# EAGLE design Div4RX5808-PRO MB_V1.2 (EAGLE 6.4)
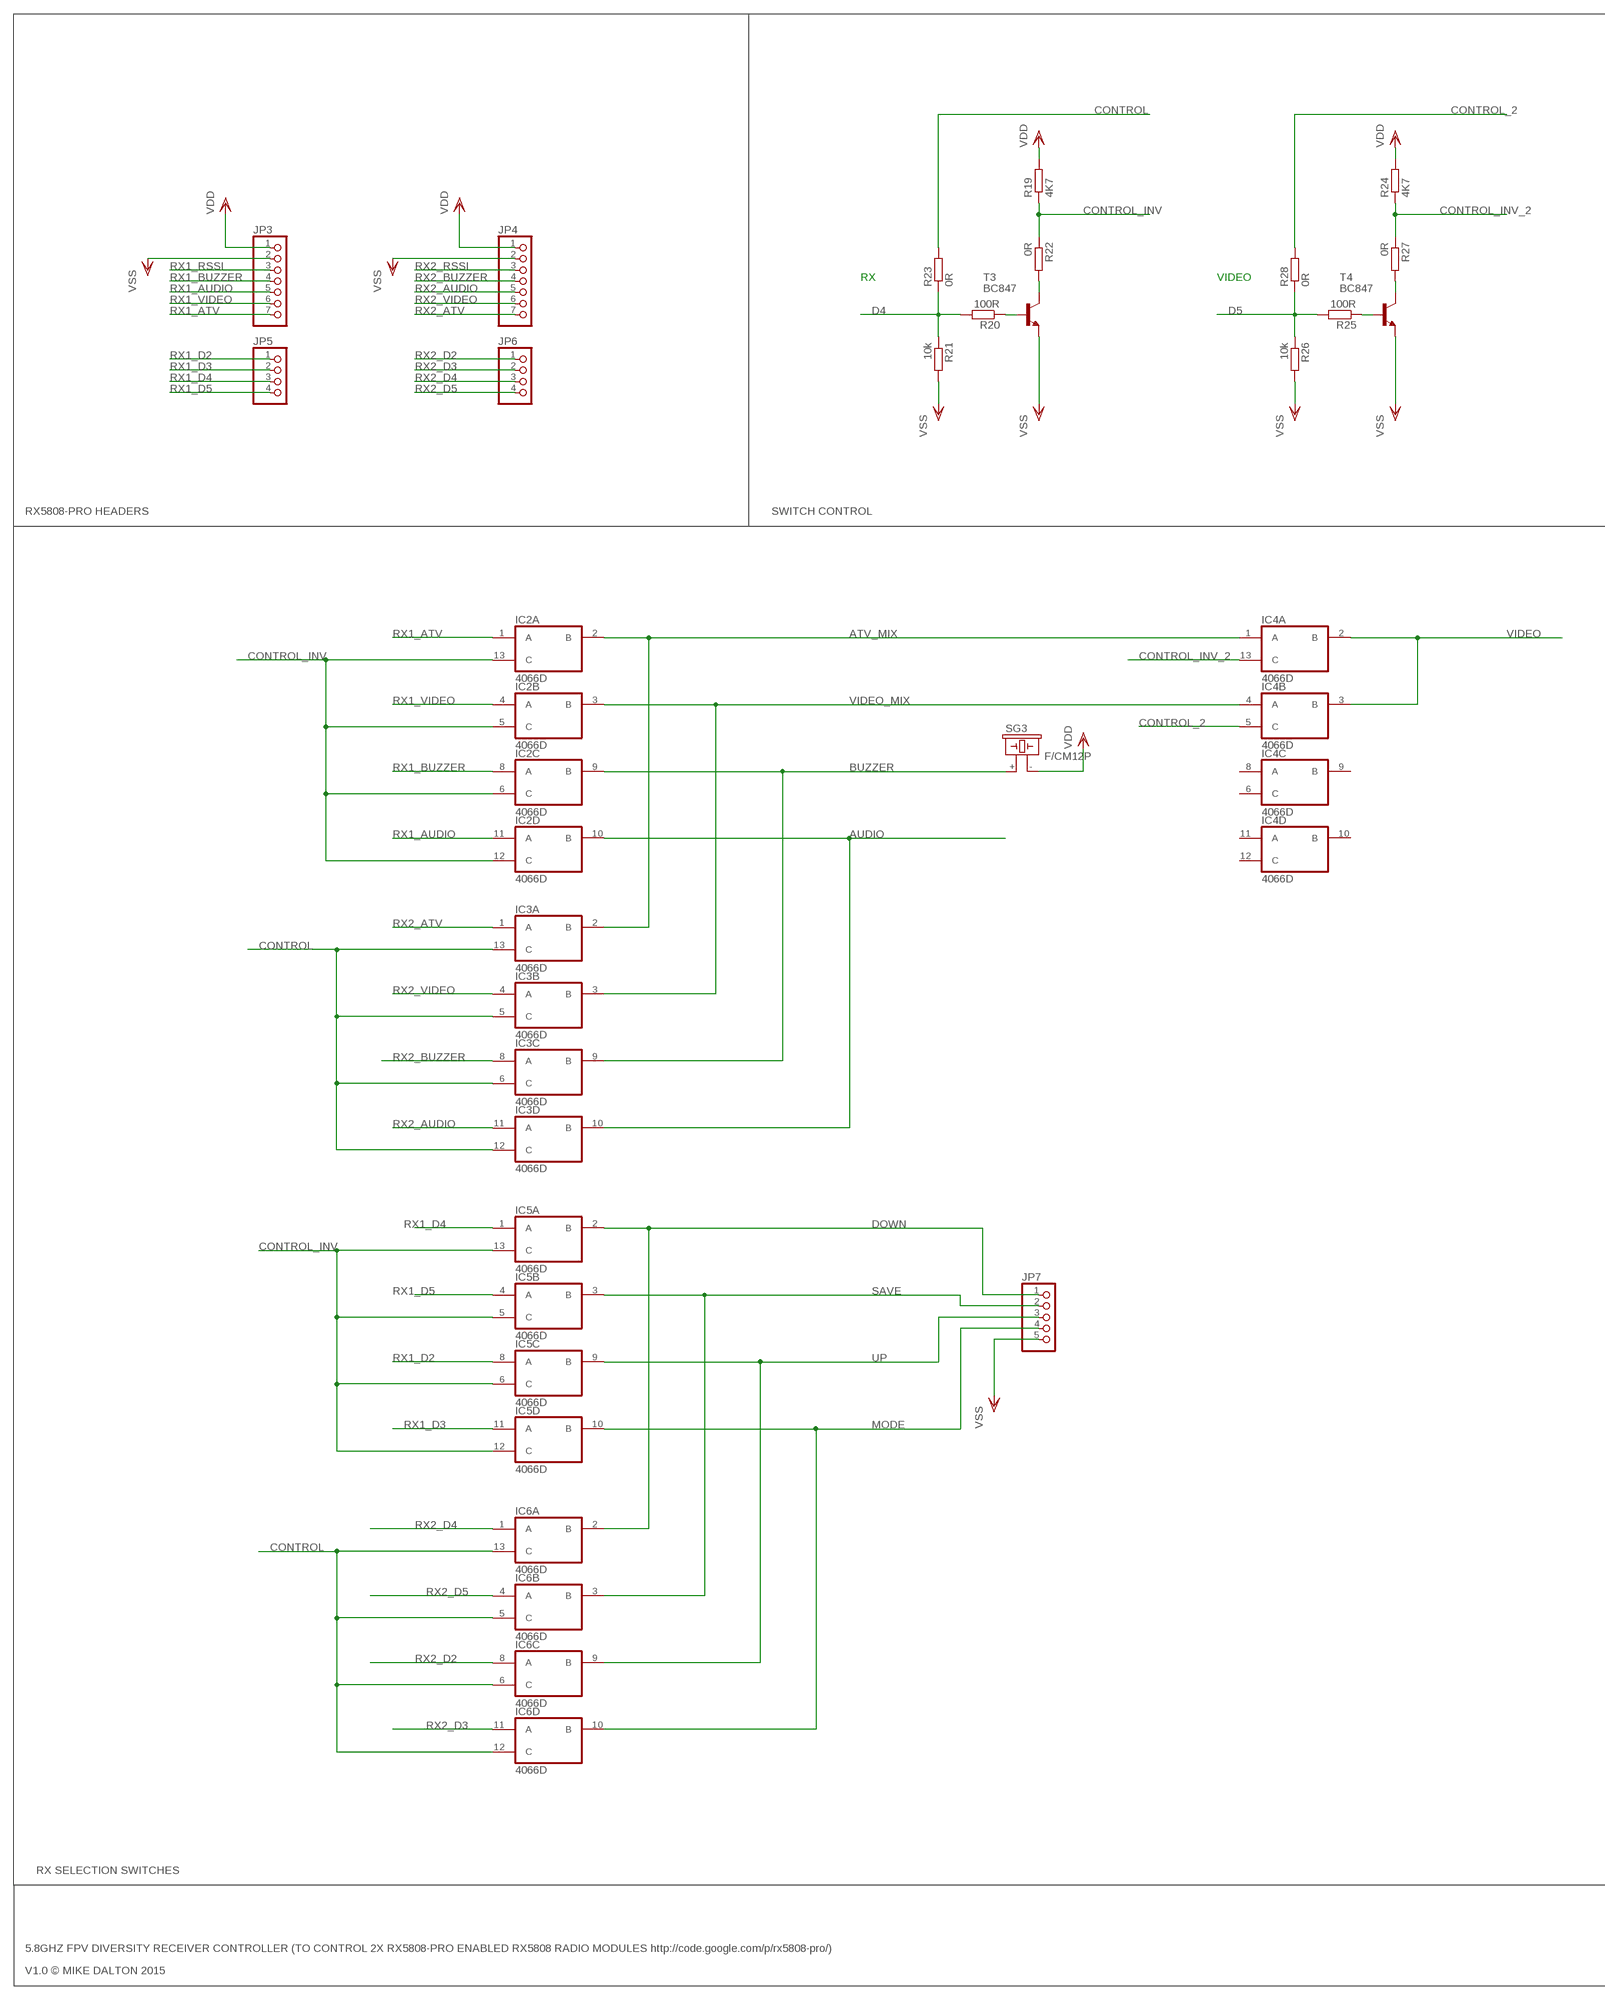
[diagram p0: schematic, sheet 1, part 1 of 2]
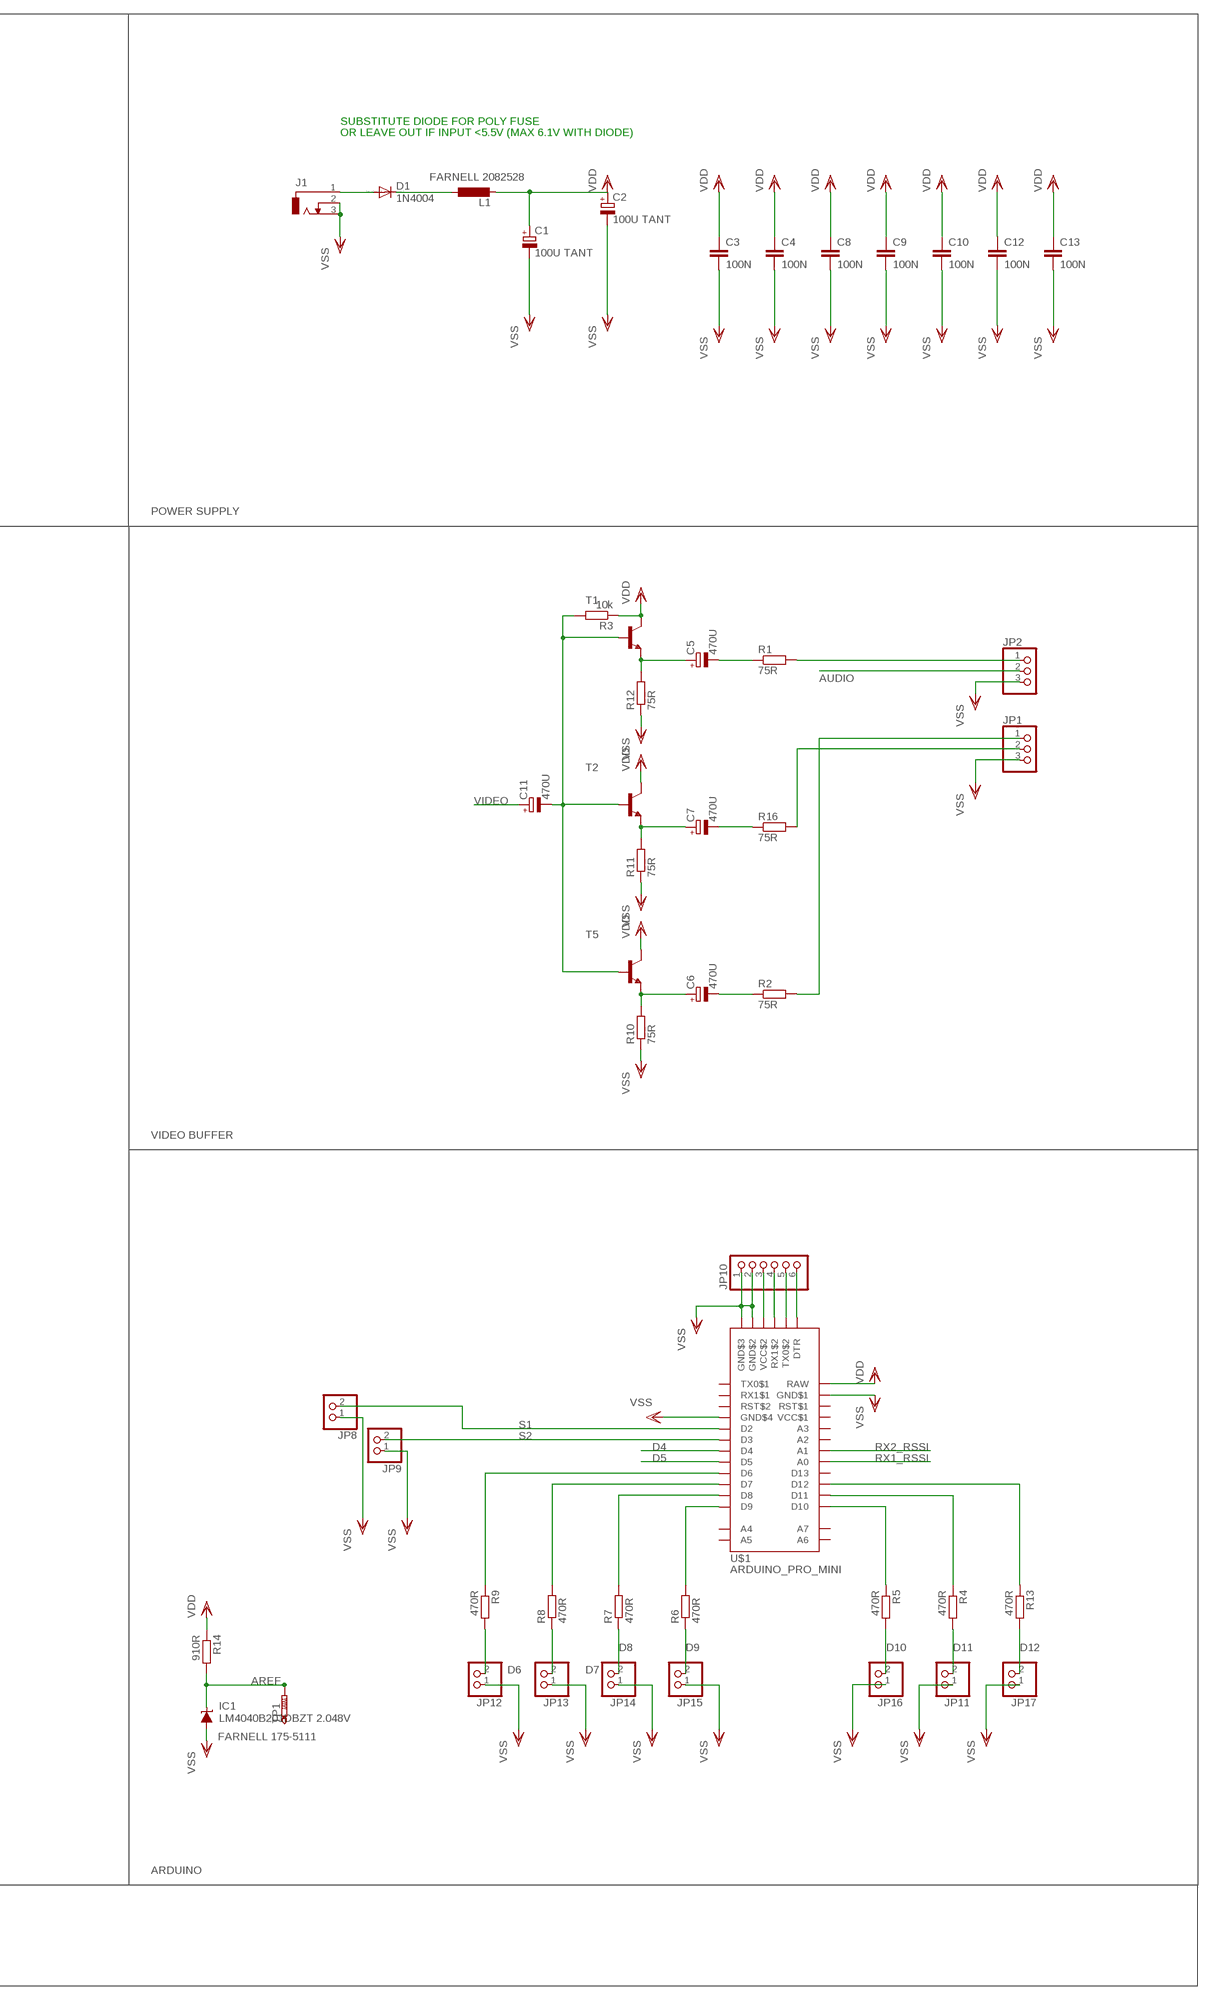
[diagram p1: schematic, sheet 1, part 2 of 2]

## Parts
C1  100U TANT  CPOL-EUC/6032-28R  [C/6032-28R]
C2  100U TANT  CPOL-EUC/6032-28R  [C/6032-28R]
C3  100N  C-EUC0603  [C0603]
C4  100N  C-EUC0603  [C0603]
C5  470U  CPOL-EUE5-10.5  [E5-10,5]
C6  470U  CPOL-EUE5-10.5  [E5-10,5]
C7  470U  CPOL-EUE5-10.5  [E5-10,5]
C8  100N  C-EUC0603  [C0603]
C9  100N  C-EUC0603  [C0603]
C10  100N  C-EUC0603  [C0603]
C11  470U  CPOL-EUE5-10.5  [E5-10,5]
C12  100N  C-EUC0603  [C0603]
C13  100N  C-EUC0603  [C0603]
D1  1N4004  [DO41-10]
IC1  LM4040B201DBZT 2.048V  LM4041A12DBZ  [DBZ_R-PDSO-G3]
IC2  4066D  [SO14]
IC3  4066D  [SO14]
IC4  4066D  [SO14]
IC5  4066D  [SO14]
IC6  4066D  [SO14]
J1  DCJ0303  [DCJ0303]
JP1  PINHD-1X3  [1X03]
JP2  PINHD-1X3  [1X03]
JP3  PINHD-1X7  [1X07]
JP4  PINHD-1X7  [1X07]
JP5  PINHD-1X4  [1X04]
JP6  PINHD-1X4  [1X04]
JP7  PINHD-1X5  [1X05]
JP8  PINHD-1X2  [1X02]
JP9  PINHD-1X2  [1X02]
JP10  PINHD-1X6  [1X06]
JP11  PINHD-1X2  [1X02]
JP12  PINHD-1X2  [1X02]
JP13  PINHD-1X2  [1X02]
JP14  PINHD-1X2  [1X02]
JP15  PINHD-1X2  [1X02]
JP16  PINHD-1X2  [1X02]
JP17  PINHD-1X2  [1X02]
L1  L-EU0207/7  [0207/7]
R1  75R  R-EU_M0805  [M0805]
R2  75R  R-EU_M0805  [M0805]
R3  10k  R-EU_M0805  [M0805]
R4  470R  R-EU_R0603  [R0603]
R5  470R  R-EU_R0603  [R0603]
R6  470R  R-EU_R0603  [R0603]
R7  470R  R-EU_R0603  [R0603]
R8  470R  R-EU_R0603  [R0603]
R9  470R  R-EU_R0603  [R0603]
R10  75R  R-EU_M0805  [M0805]
R11  75R  R-EU_M0805  [M0805]
R12  75R  R-EU_M0805  [M0805]
R13  470R  R-EU_R0603  [R0603]
R14  910R  R-EU_R0603  [R0603]
R16  75R  R-EU_M0805  [M0805]
R19  4K7  R-EU_M0805  [M0805]
R20  100R  R-EU_M0805  [M0805]
R21  10k  R-EU_M0805  [M0805]
R22  0R  R-EU_M0805  [M0805]
R23  0R  R-EU_M0805  [M0805]
R24  4K7  R-EU_M0805  [M0805]
R25  100R  R-EU_M0805  [M0805]
R26  10k  R-EU_M0805  [M0805]
R27  0R  R-EU_M0805  [M0805]
R28  0R  R-EU_M0805  [M0805]
SG3  F/CM12P  [F/CM12P]
T1  MMBT2222ALT1-NPN-SOT23-BEC  [SOT23-BEC]
T2  MMBT2222ALT1-NPN-SOT23-BEC  [SOT23-BEC]
T3  BC847  BC847B-NPN-SOT23-BEC  [SOT23-BEC]
T4  BC847  BC847B-NPN-SOT23-BEC  [SOT23-BEC]
T5  MMBT2222ALT1-NPN-SOT23-BEC  [SOT23-BEC]
TP1  PTR1TP20SQ  [TP20SQ]
U$1  ARDUINO_PRO_MINI  [ARDUINO_PRO_MINI]

## Nets
AREF: IC1.1(C) R14.2 TP1.TP
ATV_MIX: IC2.2(A:B) IC3.2(A:B) IC4.1(A:A)
AUDIO: IC2.10(D:B) IC3.10(D:B) JP2.2
BUZZER: IC2.9(C:B) IC3.9(C:B) SG3.+
CONTROL: IC3.5(B:C) IC3.6(C:C) IC3.12(D:C) IC3.13(A:C) IC6.5(B:C) IC6.6(C:C) IC6.12(D:C) IC6.13(A:C) R23.2
CONTROL_2: IC4.5(B:C) R28.2
CONTROL_INV: IC2.5(B:C) IC2.6(C:C) IC2.12(D:C) IC2.13(A:C) IC5.5(B:C) IC5.6(C:C) IC5.12(D:C) IC5.13(A:C) R19.1 R22.1
CONTROL_INV_2: IC4.13(A:C) R24.1 R27.1
D4: R20.2 R21.1 R23.1 U$1.D4
D5: R25.2 R26.1 R28.1 U$1.D5
D6: JP12.2 R9.2
D7: JP13.2 R8.1
D8: JP14.2 R7.1
D9: JP15.2 R6.1
D10: JP16.2 R5.2
D11: JP11.2 R4.2
D12: JP17.2 R13.2
DOWN: IC5.2(A:B) IC6.2(A:B) JP7.1
MODE: IC5.10(D:B) IC6.10(D:B) JP7.4
N$1: D1.C L1.1
N$3: D1.A J1.1
N$4: R13.1 U$1.D12
N$5: C5.- R1.1
N$6: C6.- R2.1
N$16: JP2.1 R1.2
N$18: C7.- R16.1
N$24: JP1.2 R16.2
N$25: JP1.1 R2.2
N$26: C5.+ R12.2 T1.E
N$30: JP10.6 U$1.DTR
N$32: JP10.5 U$1.TX0$2
N$33: C7.+ R11.2 T2.E
N$35: JP10.4 U$1.RX1$2
N$36: JP10.3 U$1.VCC$2
N$47: R25.1 T4.B
N$48: C6.+ R10.2 T5.E
N$49: R22.2 T3.C
N$50: R20.1 T3.B
N$51: R27.2 T4.C
N$52: C11.- R3.2 T1.B T2.B T5.B
N$58: R9.1 U$1.D6
N$59: R8.2 U$1.D7
N$62: R6.2 U$1.D9
N$64: R4.1 U$1.D11
N$65: R5.1 U$1.D10
N$590: R7.2 U$1.D8
RX1_ATV: IC2.1(A:A) JP3.7
RX1_AUDIO: IC2.11(D:A) JP3.5
RX1_BUZZER: IC2.8(C:A) JP3.4
RX1_D2: IC5.8(C:A) JP5.1
RX1_D3: IC5.11(D:A) JP5.2
RX1_D4: IC5.1(A:A) JP5.3
RX1_D5: IC5.4(B:A) JP5.4
RX1_RSSI: JP3.3 U$1.A0
RX1_VIDEO: IC2.4(B:A) JP3.6
RX2_ATV: IC3.1(A:A) JP4.7
RX2_AUDIO: IC3.11(D:A) JP4.5
RX2_BUZZER: IC3.8(C:A) JP4.4
RX2_D2: IC6.8(C:A) JP6.1
RX2_D3: IC6.11(D:A) JP6.2
RX2_D4: IC6.1(A:A) JP6.3
RX2_D5: IC6.4(B:A) JP6.4
RX2_RSSI: JP4.3 U$1.A1
RX2_VIDEO: IC3.4(B:A) JP4.6
S1: JP8.2 U$1.D2
S2: JP9.2 U$1.D3
SAVE: IC5.3(B:B) IC6.3(B:B) JP7.2
UP: IC5.9(C:B) IC6.9(C:B) JP7.3
VDD: C1.+ C2.+ C3.1 C4.1 C8.1 C9.1 C10.1 C12.1 C13.1 JP3.1 JP4.1 L1.2 R3.1 R14.1 R19.2 R24.2 SG3.- T1.C T2.C T5.C U$1.RAW
VIDEO: C11.+ IC4.2(A:B) IC4.3(B:B)
VIDEO_MIX: IC2.3(B:B) IC3.3(B:B) IC4.4(B:A)
VSS: C1.- C2.- C3.2 C4.2 C8.2 C9.2 C10.2 C12.2 C13.2 IC1.2(A) J1.2 J1.3 JP1.3 JP2.3 JP3.2 JP4.2 JP7.5 JP8.1 JP9.1 JP10.1 JP10.2 JP11.1 JP12.1 JP13.1 JP14.1 JP15.1 JP16.1 JP17.1 R10.1 R11.1 R12.1 R21.2 R26.2 T3.E T4.E U$1.GDN$1(GND$1) U$1.GND$2 U$1.GND$3 U$1.GND$4
Unconnected: IC4.6(C:C) IC4.8(C:A) IC4.9(C:B) IC4.10(D:B) IC4.11(D:A) IC4.12(D:C) U$1.A2 U$1.A3 U$1.A4 U$1.A5 U$1.A6 U$1.A7 U$1.D13 U$1.RST$1 U$1.RST$2 U$1.RX1$1 U$1.TX0$1

## Notes on the sheet
- SUBSTITUTE DIODE FOR POLY FUSE
- OR LEAVE OUT IF INPUT <5.5V (MAX 6.1V WITH DIODE)
- FARNELL 2082528
- RX | VIDEO
- RX5808-PRO HEADERS | SWITCH CONTROL | POWER SUPPLY
- VIDEO BUFFER
- FARNELL 175-5111
- RX SELECTION SWITCHES | ARDUINO
- 5.8GHZ FPV DIVERSITY RECEIVER CONTROLLER (TO CONTROL 2X RX5808-PRO ENABLED RX5808 RADIO MODULES http://code.google.com/p/rx5808-pro/)
- V1.0 © MIKE DALTON 2015

## Power pins joined to a net without a drawn wire
VCC$1: U$1.VCC$1
VDD: IC2.14(P:VDD) IC3.14(P:VDD) IC4.14(P:VDD) IC5.14(P:VDD) IC6.14(P:VDD)
VSS: IC2.7(P:VSS) IC3.7(P:VSS) IC4.7(P:VSS) IC5.7(P:VSS) IC6.7(P:VSS)

## Library data of the parts
C1 C2 C5-C7 C11 = rcl:CPOL-EU: POLARIZED CAPACITOR, European symbol
C3 C4 C8-C10 C12 C13 = rcl:C-EU: CAPACITOR, European symbol
D1 = diode:1N4004: DIODE general purpose rectifier, 1 A
IC1 = texas:LM4041: PRECISION MICROPOWER SHUNT VOLTAGE REFERENCE Source: http://focus.ti.com/lit/ds/slcs146e/slcs146e.pdf; MPN: LM4041A12IDBZR; OC_FARNELL: 1407949; OC_NEWARK: 58K5875
IC2-IC6 = 40xx:4066: Quad bilateral ANALOG SWITCH
J1 = con-jack:DCJ0303: DC POWER JACK Source: DCJ0303.pdf; OC_FARNELL: unknown; OC_NEWARK: unknown
JP1 JP2 = pinhead:PINHD-1X3: PIN HEADER
JP3 JP4 = pinhead:PINHD-1X7: PIN HEADER
JP5 JP6 = pinhead:PINHD-1X4: PIN HEADER
JP7 = pinhead:PINHD-1X5: PIN HEADER
JP8 JP9 JP11-JP17 = pinhead:PINHD-1X2: PIN HEADER
JP10 = pinhead:PINHD-1X6: PIN HEADER
L1 = rcl:L-EU: INDUCTOR, European symbol
R1-R14 R16 R19-R28 = rcl:R-EU_: RESISTOR, European symbol
SG3 = buzzer:F/CM12P: BUZZER Source: Buerklin; OC_FARNELL: unknown; OC_NEWARK: unknown
T1 T2 T5 = transistor-neu-to92:*-NPN-: NPN Transistror BF959 corrected 2008.03.06
T3 T4 = transistor:*-NPN-: NPN Transistror BF959 corrected 2008.03.06
TP1 = testpad:PTR1: TEST PIN
U$1 = srg:ARDUINO_PRO_MINI: Arduino Pro-Mini Made by Sparkfun Comes in 3.3 volt <http://www.sparkfun.com/products/11113> and 5 volt <http://www.sparkfun.com/products/11114> versions Note: A6 & A7 are analog in only

## Board
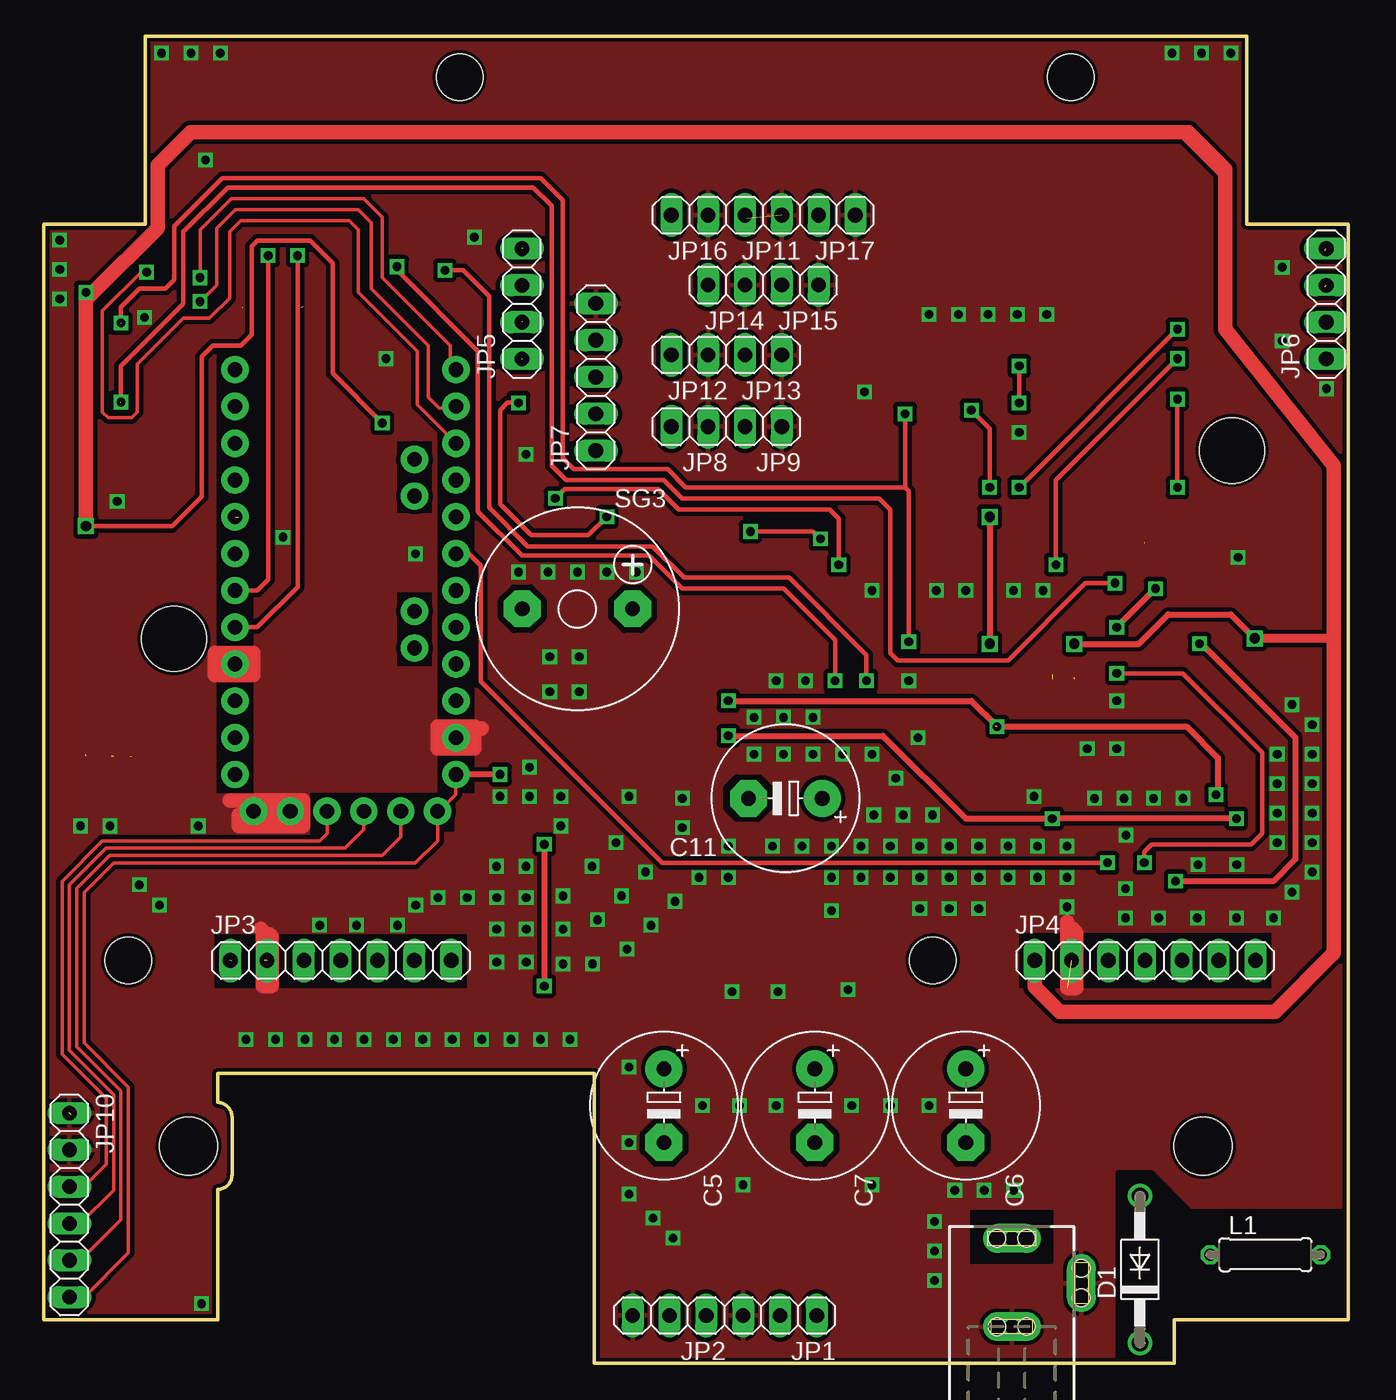
[diagram p2: board, top side]
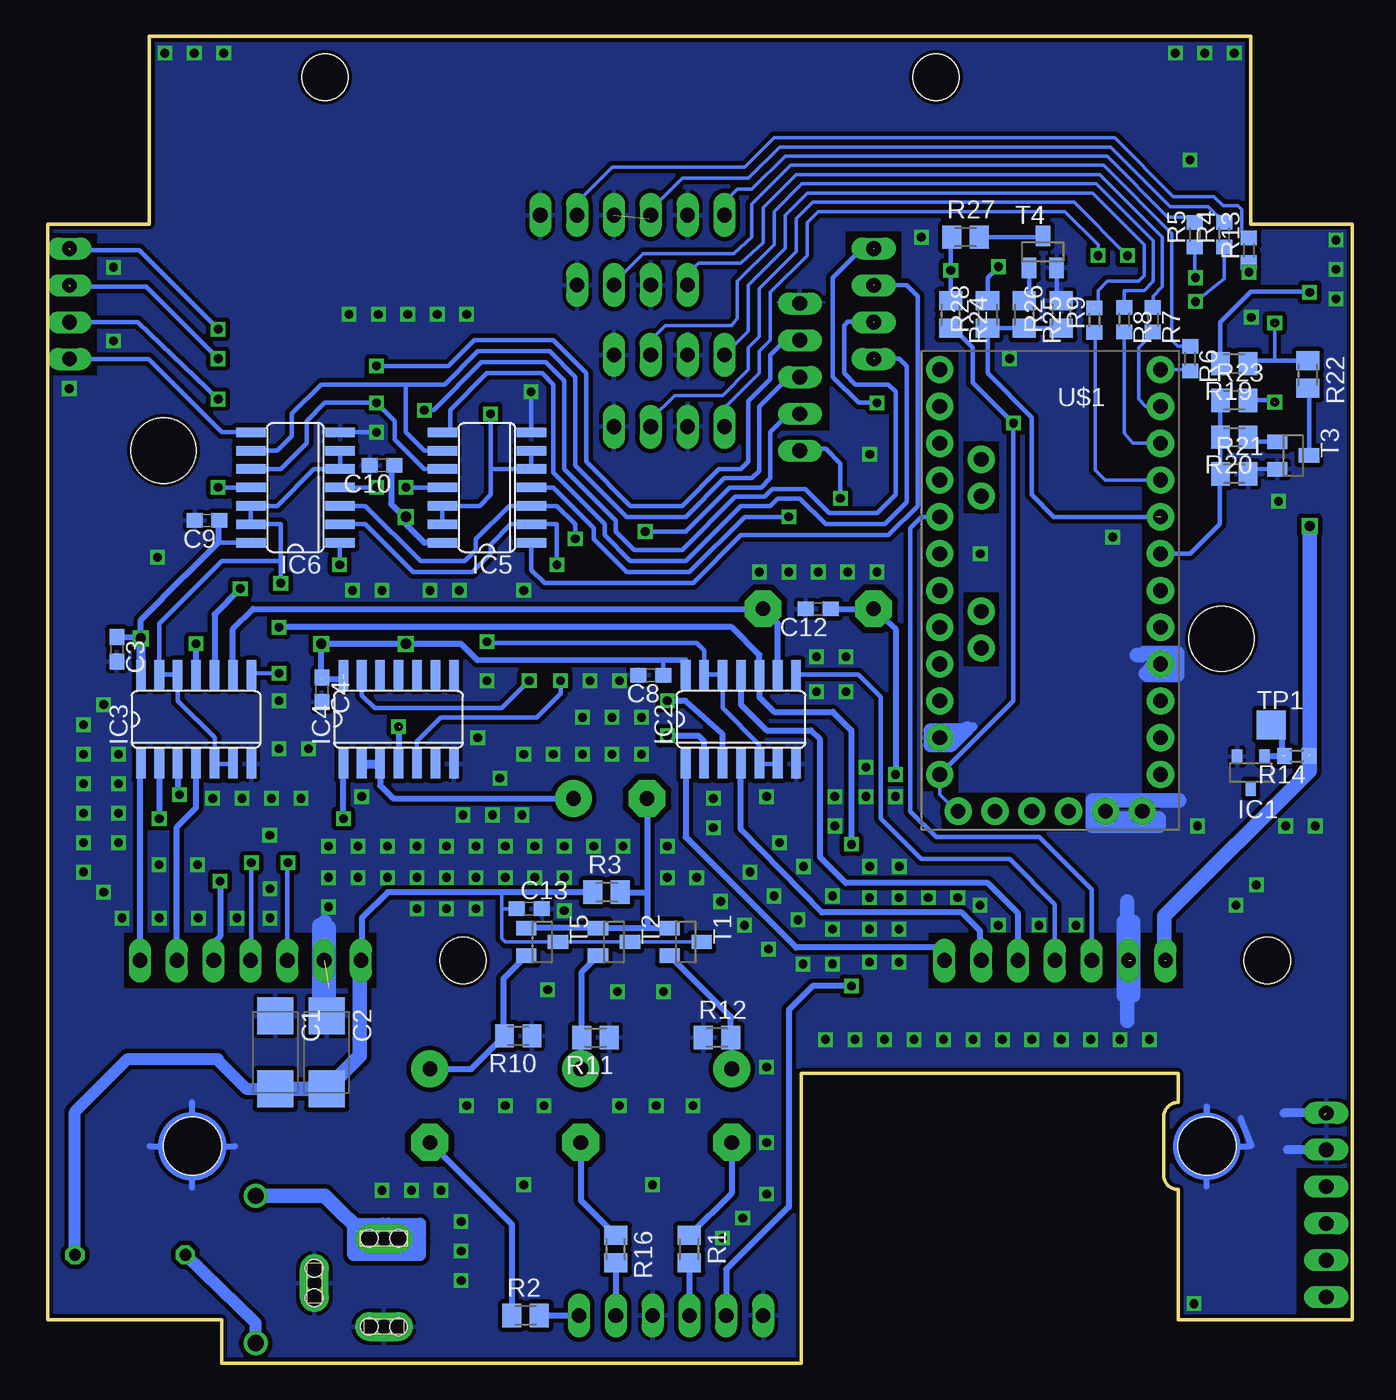
[diagram p3: board, bottom side, seen from below]

Size 90 x 91.59 mm. Coordinates in mm from the lower left corner, seen from the top.
Outline: 38,0 78,0 78,3 90,3 90,78.64 83,78.64 83,91.59 7,91.59 7,78.64 0,78.64 0,3 12,3 12,12 arc90 13,13 13,17 arc90 12,18 12,20 38,20 38,0
Copper layers (1*16): Top 0.035mm / dielectric 1.5mm / Bottom 0.035mm
Design rules "default *": minimum track width 10mil, minimum drill 24mil, track to track 12mil, track to pad 12mil, pad to pad 12mil, via to via 12mil, smd to smd 12mil, copper to edge 10mil, drill to drill 10mil, minimum pad ring 10mil, minimum via ring 8mil, stop-mask expansion 4mil, vias tented up to drill 0mil, thermal gap 10mil
Holes 4 mm at 80,15 10,15
Holes 4.5 mm at 9,50 82,63
Holes 1.2 mm at 65.79,8.64 67.82,8.64 71.6,6.55 71.6,4.52 67.82,2.54 65.79,2.51
Holes 3.2 mm at 28.7,88.77 70.87,88.77 61.34,27.81 5.84,27.81
bKeepout: area 11.9,36.8 to 14.4,69.8
tRestrict: area 18.4,36.7 to 28.3,39.4; area 11.9,39.4 to 14.5,47; area 11.9,49.5 to 14.5,69.8; area 27.2,39.4 to 29.7,41.9; area 27.2,44.5 to 29.7,69.8; area 24.4,48.1 to 26.8,53.2; area 24.4,58.7 to 26.8,63.6; area 67.3,25.9 to 84.7,29.7; area 11.8,25.9 to 29.2,29.6; area 64,6.9 to 69.5,10.5; area 74,-0.4 to 90,13.2; 102 lines
bRestrict: area 27.2,39.5 to 29.6,69.8; area 18.4,36.7 to 28.3,39.4; area 24.4,58.7 to 26.8,63.5; area 24.4,63.4 to 26.8,63.6; area 24.4,48.1 to 26.8,53.2; area 86.6,68.2 to 90,78; area 0.1,-1.9 to 3.8,13.5; area 36.1,64.4 to 40,73.2; area 31.1,68.2 to 34.9,78.1; area 67.3,25.9 to 84.7,29.7; area 11.7,25.9 to 29.2,29.7; area 11.9,39.4 to 14.5,47; 1 more areas; 111 lines

### Footprints (pad centres in the part's own frame; a part is rotated, then mirrored left to right if it is on the bottom)
C/6032-28R = smd 2.55 x 2.5: + 2.525,0; - -2.525,0
C0603 = smd 1.1 x 1: 1 -0.85,0; 2 0.85,0
E5-10,5 = drill 1.016 pad 2.54: + -2.54,0 | drill 1.016 pad 2.54 octagon: - 2.54,0
DO41-10 = drill 1.118: A 5.08,0; C -5.08,0
DBZ_R-PDSO-G3 = smd 0.7 x 1: 1 -0.95,-1.1; 2 0.95,-1.1; 3 0,1.1
SO14 = smd 0.66 x 2.032: 1 -3.81,-3.073; 2 -2.54,-3.073; 3 -1.27,-3.073; 4 0,-3.073; 5 1.27,-3.073; 6 2.54,-3.073; 7 3.81,-3.073; 8 3.81,3.073; 9 2.54,3.073; 10 1.27,3.073; 11 0,3.073; 12 -1.27,3.073; 13 -2.54,3.073; 14 -3.81,3.073
DCJ0303 = drill 1 pad 2 long: 1 0,3.1; 2 4.8,0; 3 0,-3
1X03 = drill 1.016 long: 1 -2.54,0; 2 0,0; 3 2.54,0
1X07 = drill 1.016 long: 1 -7.62,0; 2 -5.08,0; 3 -2.54,0; 4 0,0; 5 2.54,0; 6 5.08,0; 7 7.62,0
1X04 = drill 1.016 long: 1 -3.81,0; 2 -1.27,0; 3 1.27,0; 4 3.81,0
1X05 = drill 1.016 long: 1 -5.08,0; 2 -2.54,0; 3 0,0; 4 2.54,0; 5 5.08,0
1X02 = drill 1.016 long: 1 -1.27,0; 2 1.27,0
1X06 = drill 1.016 long: 1 -6.35,0; 2 -3.81,0; 3 -1.27,0; 4 1.27,0; 5 3.81,0; 6 6.35,0
0207/7 = drill 0.813 octagon: 1 -3.81,0; 2 3.81,0
M0805 = smd 1.3 x 1.6: 1 -0.95,0; 2 0.95,0
R0603 = smd 1 x 1.1: 1 -0.85,0; 2 0.85,0
F/CM12P = drill 1.016 pad 2.54 octagon: + 3.81,0; - -3.81,0
SOT23-BEC = smd 1 x 1.4: B -0.95,-1.1; C 0,1.1; E 0.95,-1.1
TP20SQ = smd 2 x 2: TP 0,0
ARDUINO_PRO_MINI = drill 1.016 pad 1.88: A0 7.62,-5.08; A1 7.62,-2.54; A2 7.62,0; A3 7.62,2.54; A4 4.763,1.429; A5 4.763,3.969; A6 4.763,-9.049; A7 4.763,-6.509; D2 -7.62,2.54; D3 -7.62,0; D4 -7.62,-2.54; D5 -7.62,-5.08; D6 -7.62,-7.62; D7 -7.62,-10.16; D8 -7.62,-12.7; D9 -7.62,-15.24; D10 7.62,-15.24; D11 7.62,-12.7; D12 7.62,-10.16; D13 7.62,-7.62; DTR 6.35,15.24; GDN$1 7.62,10.16; GND$2 -3.81,15.24; GND$3 -6.35,15.24; GND$4 -7.62,5.08; RAW 7.62,12.7; RST$1 7.62,7.62; RST$2 -7.62,7.62; RX1$1 -7.62,10.16; RX1$2 1.27,15.24; TX0$1 -7.62,12.7; TX0$2 3.81,15.24; VCC$1 7.62,5.08; VCC$2 -1.27,15.24

### Placement (x,y rotation side)
C1  74.3,21.46 270 bottom
C2  70.74,21.46 270 bottom
C3  85.22,49.28 270 bottom
C4  71.07,46.48 270 bottom
C5  42.8,17.78 270 top
C6  63.63,17.78 270 top
C7  53.21,17.78 270 top
C8  48.39,47.5 180 bottom
C9  78.99,58.17 180 bottom
C10  66.93,61.98 180 bottom
C11  51.18,38.99 180 top
C12  36.83,52.07 180 bottom
C13  56.77,31.37 0 bottom
D1  75.64,6.48 90 top
IC1  6.99,40.77 180 bottom
IC2  42.16,44.45 0 bottom
IC3  79.76,44.45 0 bottom
IC4  65.79,44.45 0 bottom
IC5  59.69,60.45 90 bottom
IC6  72.9,60.45 90 bottom
J1  66.8,5.53 0 top
JP1  50.8,3.3 180 top
JP2  43.18,3.3 180 top
JP3  20.5,27.8 0 top
JP4  76,27.8 0 top
JP5  33,73.13 90 top
JP6  88.5,73.13 90 top
JP7  38.1,68.07 90 top
JP8  44.58,64.64 180 top
JP9  49.66,64.64 180 top
JP10  1.78,10.92 270 top
JP11  49.66,79.25 180 top
JP12  44.58,69.6 180 top
JP13  49.66,69.6 180 top
JP14  47.12,74.42 180 top
JP15  52.2,74.42 180 top
JP16  44.58,79.25 180 top
JP17  54.74,79.25 180 top
L1  84.3,7.49 0 top
R1  45.72,7.87 270 bottom
R2  57.02,3.3 0 bottom
R3  51.44,32.51 0 bottom
R4  8.81,77.9 90 bottom
R5  10.85,77.9 90 bottom
R6  11.18,69.34 270 bottom
R7  13.74,72.03 270 bottom
R8  15.72,72.03 270 bottom
R9  17.78,72.01 90 bottom
R10  57.53,22.61 180 bottom
R11  52.2,22.48 180 bottom
R12  43.81,22.48 0 bottom
R13  7.11,76.83 90 bottom
R14  3.81,41.91 180 bottom
R16  50.8,7.87 270 bottom
R19  8.13,69.01 180 bottom
R20  8.13,63.93 180 bottom
R21  8.13,61.39 0 bottom
R22  3.05,68.25 270 bottom
R23  8.13,66.47 0 bottom
R24  27.69,72.39 270 bottom
R25  22.61,72.39 270 bottom
R26  20.07,72.39 90 bottom
R27  26.67,77.72 0 bottom
R28  25.15,72.39 90 bottom
SG3  36.83,52.07 0 top
T1  45.97,29.08 270 bottom
T2  50.93,29.08 270 bottom
T3  4.06,62.66 270 bottom
T4  21.34,76.71 0 bottom
T5  55.88,29.08 270 bottom
TP1  5.59,44.07 0 bottom
U$1  20.83,53.34 180 bottom

### Tracks (layer width: path | path; a pad name or v marks a point on that pad's centre or on a via)
AREF  (2 unrouted)
  Bottom 0.406: 5.97,41.91 4.83,41.91 4.83,43.94 TP1.TP
ATV_MIX  (via drill 0.6)
  Top 0.406: v47.24,43.31 57.91,43.31 63.63,37.59 v69.6,37.59 v82.3,37.59
  Bottom 0.406: IC2.2 44.7,42.93 45.09,43.31 v47.24,43.31 | v69.6,37.59 IC4.1 | IC3.2 v82.3,37.59
AUDIO  (via drill 0.6)
  Top 0.406: v34.54,35.81 v34.54,26.04 | v74.04,50.8 v76.71,53.47
  Bottom 0.406: v34.54,35.81 34.54,43.69 35.81,44.96 39.88,44.96 40.89,45.97 IC2.10 40.89,48.9 42.8,50.8 v74.04,50.8 | v34.54,26.04 37.21,26.04 38.86,24.38 38.86,10.79 43.18,6.48 JP2.2 | v76.71,53.47 78.49,51.69 IC3.10
BUZZER
  Bottom 0.406: IC2.9 39.62,51.05 40.51,51.94 | 40.51,51.94 40.58,52.01 | 40.58,52.01 SG3.+ | IC3.9 77.22,50.67 75.82,52.07 SG3.+ | 40.39,52.07 40.51,51.94 | SG3.+ 39.75,51.82 40.58,52.01
CONTROL  (via drill 0.6)  (1 unrouted)
  Top 0.305: v73.91,53.85 71.88,53.85 66.55,48.51 58.93,48.51 58.42,49.02 58.42,58.93 57.66,59.69 44.07,59.69 42.8,60.96 36.07,60.96 35.05,61.98 35.05,79.88 33.78,81.15 12.7,81.15 9.65,78.11 9.65,73.15 5.33,68.83 5.33,66.29
  Bottom 0.305: IC6.6 IC6.5 71.63,61.72 74.17,59.18 IC6.12 IC6.13 73.91,57.91 73.91,55.37 | IC3.6 IC3.5 78.49,43.18 81.03,45.72 IC3.12 IC3.13 82.3,51.05 77.98,55.37 73.91,55.37 | R23.2 5.59,66.47 v5.33,66.34 | v73.91,53.85 73.91,55.37
CONTROL_2  (via drill 0.6)
  Top 0.305: v24.38,75.69 24.38,75.44 29.97,69.85 29.97,58.8 33.02,55.75 41.78,55.75 44.07,53.47 51.05,53.47 54.61,49.91 v54.61,47.12
  Bottom 0.305: R28.2 25.15,74.93 v24.38,75.69 | v54.61,47.12 54.61,46.23 56.26,44.58 62.87,44.58 64.52,42.93 IC4.5
CONTROL_INV  (via drill 0.6)  (1 unrouted)
  Top 0.305: v59.44,65.53 59.44,60.45 | 59.44,60.45 59.69,60.2 v59.69,49.81 | 59.44,60.45 44.32,60.45 43.05,61.72 36.58,61.72 35.81,62.48 35.81,80.26 34.29,81.79 12.32,81.79 9.02,78.49 9.02,74.8 8.38,74.17 6.6,74.17 5.33,72.9 5.33,71.75
  Bottom 0.254: v5.33,71.8 5.33,69.26 5.27,69.2
  Bottom 0.305: IC5.6 IC5.5 59.44,61.72 | IC5.13 IC5.12 60.2,59.18 59.44,59.94 59.44,61.72 | IC2.6 IC2.5 40.89,42.67 43.43,45.21 IC2.12 IC2.13 44.7,49.2 45.21,49.71 59.28,49.71 v59.69,49.81 | 59.44,61.72 v59.44,65.53 | R22.1 5.27,69.2 7.37,69.2 R19.1
CONTROL_INV_2  (via drill 0.6)
  Top 0.305: v27.69,75.44 28.96,75.44 30.73,73.66 30.73,59.05 33.4,56.39 42.04,56.39 44.2,54.23 51.44,54.23 56.77,48.9 v56.77,47.12
  Bottom 0.305: R24.1 v27.69,75.44 27.69,77.66 R27.1 | IC4.13 68.33,46.1 67.44,45.21 58.67,45.21 v56.77,47.12
D4
  Bottom 0.305: R21.1 R20.2 R23.1 | 9.59,60.88 R21.1 | U$1.D4 11.18,55.88 9.14,57.91 9.14,61.32 R21.1
D5  (1 unrouted)
  Bottom 0.305: R26.1 R25.2 R28.1 25.15,68.33 22.1,65.28 22.1,59.94 20.57,58.42 13.46,58.42 | 13.46,58.17 U$1.D5
D6  (1 unrouted)
  Bottom 0.254: 17.91,72.9 17.65,72.9 17.53,73.03 17.53,74.04 16.89,74.68 14.73,74.68 14.35,75.06 14.35,77.22 17.91,80.77 37.59,80.77 39.12,79.25 39.12,76.96 41.66,74.42 41.66,71.25 JP12.2
D7
  Bottom 0.254: JP13.2 48.39,70.61 47.37,71.63 42.8,71.63 42.42,72.14 42.42,74.68 39.88,77.22 39.88,79.5 37.97,81.41 17.65,81.41 13.72,77.47 13.72,74.68 14.35,74.04 15.72,74.04 R8.1
D8  (1 unrouted)
  Bottom 0.254: JP14.2 45.85,75.31 45.09,75.95 42.16,75.95 40.64,77.34 40.64,79.76 38.35,82.04 17.4,82.04 13.08,77.72 13.08,74.3 13.72,73.66 13.72,72.9 | 13.74,73.2 R7.1
D9
  Bottom 0.254: R6.1 12.03,70.19 12.45,70.61 12.45,77.98 17.14,82.68 38.73,82.68 41.4,80.01 41.4,77.72 42.67,76.58 48.9,76.58 50.42,75.06 50.42,74.93 JP15.2
D10
  Bottom 0.254: R5.2 10.83,79.12 12.7,79.12 16.89,83.31 39.12,83.31 41.4,81.03 42.42,81.03 43.18,80.26 43.18,79.38 JP16.2
D11
  Bottom 0.254: JP11.2 48.39,79.63 46.23,81.79 41.66,81.79 39.5,83.95 16.64,83.95 12.53,79.84 9.91,79.84 R4.2
D12
  Bottom 0.254: JP17.2 53.47,80.14 51.05,82.55 41.91,82.55 39.88,84.58 16.38,84.58 12.32,80.52 9.53,80.52 8.89,79.88 7.87,79.88 7.62,79.63 7.62,78.11 7.28,77.85
  Bottom 0.305: 7.28,77.85 R13.2
DOWN  (via drill 0.6)
  Top 0.305: v35.31,59.69 35.94,60.33 42.42,60.33 43.81,58.93 54.23,58.93 54.86,58.29 v54.86,55.12
  Bottom 0.305: IC6.2 68.07,57.91 64.77,54.61 60.71,54.61 59.44,55.88 59.44,56.52 58.04,57.91 IC5.2 54.86,57.91 v54.86,55.12 | JP7.1 37.97,63.12 36.32,63.12 35.31,62.1 v35.31,59.69
MODE  (via drill 0.6)
  Top 0.305: v67.31,68.83 v67.31,66.29
  Bottom 0.305: IC6.10 73.91,61.72 72.14,63.5 72.14,65.02 70.87,66.29 v67.31,66.29 66.04,65.02 66.04,63.75 64.01,61.72 IC5.10 | v67.31,68.83 62.36,68.83 60.58,70.61 55.12,70.61 52.83,68.33 52.83,62.23 49.78,59.18 46.23,59.18 43.69,61.72 42.16,61.72 41.66,62.23 41.66,66.42 40.13,67.94 40.13,69.6 39.12,70.61 JP7.4
N$1
  Bottom 0.813: D1.C 75.64,2.77 L1.1
N$2
  Bottom 1.016: 64.39,9.02 65.79,9.02
N$3
  Bottom 1.016: D1.A 70.87,11.56 67.82,8.51 66.92,8.51 J1.1
N$4  (via drill 0.6)
  Top 0.254: U$1.D12 25.78,66.17 25.78,69.85 21.72,73.91 21.72,78.23 21.08,78.87 13.59,78.87 12.83,78.11 12.83,73.53 11.43,72.14 9.65,72.14 6.48,68.96 6.48,65.66 6.1,65.28 4.45,65.28 4.06,65.66 4.06,72.64 6.6,75.18 7.11,75.18 v7.11,75.31
  Bottom 0.254: R13.1 6.9,75.98 v7.11,75.31
N$5
  Bottom 0.406: C5.- 42.8,11.74 R1.1
N$6
  Bottom 0.406: C6.- 57.97,9.59 R2.1
N$9
  Bottom 0.406: 82.3,41.27 82.3,41.15
N$10
  Bottom 0.305: 33.02,76.96 34.29,76.96
N$16
  Bottom 0.406: R1.2 JP2.1
N$18
  Bottom 0.406: C7.- 53.21,11.24 R16.1
  Bottom 0.61: C7.- 53.31,15.42
N$22
  Bottom 0.305: 83.57,28.57 83.57,29.46
N$24
  Bottom 0.406: R16.2 JP1.2
  Bottom 0.61: 50.67,3.05 JP1.2
N$25
  Bottom 0.406: 53.26,3.91 53.34,3.91 JP1.1 R2.2
  Bottom 0.61: 53.19,3.12 JP1.1
N$26
  Bottom 0.406: C5.+ 42.8,22.93 R12.2 42.86,23.92 T1.E
N$30
  Top 0.254: U$1.DTR 27.18,36.07 25.65,34.54 4.83,34.54 2.79,32.51 2.79,22.1 5.84,19.05 5.84,7.62 2.79,4.57 JP10.6
N$32
  Top 0.254: U$1.TX0$2 24.64,36.32 23.37,35.05 4.57,35.05 2.29,32.77 2.29,21.84 5.33,18.8 5.33,9.91 2.54,7.11 JP10.5
N$33
  Bottom 0.406: C7.+ 53.21,22.92 R11.2 53.15,27.01 T2.E
N$35
  Top 0.254: U$1.RX1$2 22.1,36.83 20.83,35.56 4.32,35.56 1.78,33.02 1.78,21.59 4.83,18.54 4.83,11.94 2.54,9.65 JP10.4
N$36
  Top 0.254: U$1.VCC$2 19.56,36.58 19.05,36.07 4.06,36.07 1.27,33.27 1.27,21.34 4.32,18.29 4.32,13.72 2.54,11.94 2.03,11.94 JP10.3
N$40
  Bottom 0.813: 66.88,9.63 66.5,9.63 64.31,9.63 64.31,7.47 68.91,7.47 68.91,9.09 68.91,9.53 68.91,9.63 66.88,9.63
N$47
  Bottom 0.305: T4.B 22.29,73.66 R25.1
N$48
  Bottom 0.406: C6.+ 60.77,20.32 R10.2 58.55,22.67 58.55,26.54 56.98,28.11 T5.E
N$49
  Bottom 0.305: T3.C 2.96,66.96 R22.2
N$50
  Bottom 0.305: T3.B 6.86,63.61 R20.1
N$51
  Bottom 0.305: R27.2 21.42,77.72 T4.C
N$52
  Bottom 0.406: C11.- 48.64,32.51 | 48.64,32.51 48.64,30.03 | 48.64,30.03 T1.B | T5.B T2.B 48.64,30.03 | R3.2 48.64,32.51
N$55
  Bottom 0.254: 28.45,40.51 28.45,39.24 27.18,37.97
N$58
  Bottom 0.254: U$1.D6 17.02,60.96 17.72,61.66 17.72,71.1 R9.1
N$59
  Bottom 0.254: U$1.D7 15.14,63.5 15.72,64.21 R8.2
N$62
  Bottom 0.254: U$1.D9 11.26,68.58 R6.2
N$64  (via drill 0.6)
  Top 0.254: v10.79,73.28 11.94,74.42 11.94,78.36 13.21,79.63 21.72,79.63 22.61,78.74 22.61,74.17 26.54,70.23 26.54,66.67 27.3,65.91 28.32,65.91 U$1.D11
  Bottom 0.254: v10.79,73.28 8.81,74.88 R4.1
  Bottom 0.305: R4.1 8.87,77.05
N$65  (via drill 0.6)
  Top 0.254: v10.79,74.93 10.79,78.23 12.95,80.39 22.1,80.39 23.37,79.12 23.37,74.93 28.07,70.23 28.07,68.96 U$1.D10
  Bottom 0.254: R5.1 10.85,75.01 v10.79,74.93
N$66
  Top 0.305: 51.44,54.23 44.2,54.23 43.69,54.74
N$67
  Bottom 1.016: 68.07,8.66 66.95,8.66 66.9,8.61
N$68
  Bottom 1.27: 64.52,8.38 64.64,8.38 65.02,8
N$590
  Bottom 0.254: U$1.D8 13.36,66.04 14.22,66.04 14.73,66.55 14.73,70.1 13.74,71.09 R7.2
RX1_ATV
  Bottom 0.406: IC2.1 45.97,36.32 38.35,28.7 28.57,28.7 27.56,27.69 28.13,27.81 JP3.7
RX1_AUDIO
  Bottom 0.406: IC2.11 42.16,45.47 40.39,43.69 37.34,43.69 36.7,43.05 36.7,34.92 34.92,33.15 25.15,33.15 23.04,31.04 JP3.5
RX1_BUZZER
  Bottom 0.305: JP3.4 20.5,31.68 23.62,34.8 29.72,34.8 32.51,37.59 32.51,45.97 34.06,47.52 IC2.8
RX1_D2  (1 unrouted)
  Bottom 0.305: JP5.1 33.02,69.3 | IC5.8 62.23,64.29 62.23,65.79 59.69,68.33 55.88,68.33 55.12,67.56 55.12,61.47 51.56,57.91 51.56,57.15 49.78,55.37 45.97,55.37 42.16,59.18 40.13,59.18 39.62,59.69 38.1,59.69 36.32,57.91 32.26,57.91 30.73,59.44 30.73,68.83 31.24,69.34 32.98,69.34
RX1_D3  (via drill 0.6)  (1 unrouted)
  Top 0.305: v64.01,65.79 65.28,64.52 v65.28,60.45
  Bottom 0.305: 33.02,71.88 34.8,71.88 35.05,71.63 35.05,68.33 34.29,67.56 32,67.56 31.5,67.06 31.5,59.94 32.77,58.67 36.07,58.67 37.72,60.33 40.01,60.33 40.51,59.82 42.55,59.82 46.23,56.13 49.53,56.13 50.8,57.4 50.8,58.17 54.36,61.72 54.36,67.82 55.63,69.09 60.07,69.09 63.37,65.79 v64.01,65.79 | v65.28,60.45 IC5.11
RX1_D4  (1 unrouted)
  Bottom 0.305: 33.02,74.42 JP5.3 | IC5.1 56.62,54.76 55.7,53.85 45.47,53.85 42.16,57.15 32,57.15 29.97,59.18 29.97,73.66 30.73,74.42 32.98,74.42
RX1_D5  (via drill 0.6)  (1 unrouted)
  Top 0.305: v32.77,66.29 32,66.29 31.5,65.79 31.5,59.31 33.66,57.15 37.59,57.15 v38.86,58.42
  Bottom 0.305: JP5.4 32.79,76.94 32.82,76.96 | IC5.4 55.12,60.45 52.32,57.66 52.32,56.9 50.04,54.61 45.72,54.61 41.91,58.42 v38.86,58.42 | v32.77,66.29 34.04,66.29 35.81,68.07 35.81,74.93 33.78,76.96 33.02,76.96
RX1_RSSI
  Bottom 0.305: U$1.A0 29.72,58.42 30.48,57.66 30.48,38.1 28.7,36.32 21.59,36.32 17.96,32.69 JP3.3
RX1_VIDEO
  Bottom 0.406: JP3.6 25.65,27.87 25.65,29.84 26.92,31.11 36.58,31.11 42.16,36.83 IC2.4
RX2_ATV
  Bottom 0.406: JP4.7 83.62,41.32 IC3.1
RX2_AUDIO  (via drill 0.6)
  Top 0.406: v78.11,33.27 84.84,33.27 86.36,34.8 86.36,43.18 79.76,49.78
  Top 0.61: v79.76,49.66 79.76,49.78
  Bottom 0.305: 78.49,27.9 JP4.5
  Bottom 0.406: IC3.11 v79.76,49.66 | v78.11,33.27 78.11,29.46 78.49,29.08 78.49,27.9
RX2_BUZZER  (via drill 0.6)
  Top 0.305: v75.95,34.54 75.95,35.31 76.45,35.81 83.31,35.81 84.07,36.58 84.07,42.16 78.61,47.62 v74.04,47.62
  Bottom 0.305: IC3.8 76.1,47.65 v74.04,47.62 | v75.95,34.54 75.95,27.9 JP4.4
RX2_D2
  Bottom 0.305: IC6.8 77.98,64.26 83.03,69.32 JP6.1
RX2_D3  (via drill 0.6)
  Top 0.305: v78.23,66.55 v78.23,60.45
  Bottom 0.305: v78.23,60.45 IC6.11 | v78.23,66.55 83.8,71.86 JP6.2
RX2_D4  (via drill 0.6)  (1 unrouted)
  Top 0.305: v78.23,69.34 69.85,60.96 v69.85,55.12
  Bottom 0.305: v69.85,55.12 69.85,56.62 IC6.1 | v78.23,69.34 83.19,74.3 88.4,74.3
RX2_D5  (via drill 0.6)  (1 unrouted)
  Top 0.305: v78.23,71.37 v67.31,60.45
  Bottom 0.305: v67.31,60.45 IC6.4 | v78.23,71.37 83.69,76.83 88.4,76.83
RX2_RSSI  (via drill 0.6)
  Top 0.305: v73.41,34.54 42.67,34.54 30.15,47.07 30.15,55.07 29.34,55.88 U$1.A1
  Bottom 0.254: 73.46,34.62 v73.41,34.54
  Bottom 0.305: JP4.3 73.46,34.62
RX2_VIDEO
  Bottom 0.406: JP4.6 81.08,37.03 79.76,38.35 IC3.4
S1  (via drill 0.6)
  Top 0.305: U$1.D2 14.73,50.8 17.53,53.59 v17.53,76.45
  Bottom 0.254: v17.53,76.45 17.53,77.22 19.81,79.5 36.83,79.5 37.59,78.74 37.59,76.45 40.13,73.91 40.13,70.61 40.89,69.85 40.89,68.33 43.31,65.91
  Bottom 0.305: JP8.2 43.31,65.91
S2  (via drill 0.6)
  Top 0.305: U$1.D3 14.73,53.34 15.49,54.1 v15.49,76.45
  Bottom 0.254: 48.39,65.15 46.74,66.8 43.43,66.8 41.66,68.58 41.66,70.1 40.89,70.87 40.89,74.17 38.35,76.71 38.35,78.99 37.21,80.14 19.18,80.14 v15.49,76.45
  Bottom 0.305: JP9.2 48.39,65.15
SAVE  (via drill 0.6)
  Top 0.305: v53.59,56.9 53.09,57.4 v48.77,57.4
  Bottom 0.305: IC6.3 68.07,59.18 64.26,55.37 61.21,55.37 60.45,56.13 60.45,56.9 58.17,59.18 IC5.3 54.86,59.18 53.59,57.91 v53.59,56.9 | JP7.2 38.86,65.53 40.13,64.26 40.13,61.09 40.77,60.45 42.93,60.45 45.97,57.4 v48.77,57.4
UP
  Bottom 0.305: IC6.9 74.17,62.99 73.15,64.01 73.15,65.53 71.12,67.56 65.28,67.56 | IC5.9 64.01,62.99 65.28,64.26 65.28,67.56 | JP7.3 38.86,68.07 40.89,66.04 40.89,61.59 41.4,61.09 43.31,61.09 45.97,58.42 50.04,58.42 53.59,61.98 53.59,68.07 55.37,69.85 60.33,69.85 62.61,67.56 65.28,67.56
VDD  (via drill 0.6, 0.7)  (6 unrouted)
  Top 0.254: U$1.RAW 28.45,39.24 27.43,38.23
  Top 0.305: v23.37,64.9 19.94,68.33 19.94,75.95 18.41,77.47 14.73,77.47 14.35,77.09 14.35,70.99 13.59,70.23 11.68,70.23 10.92,69.47 10.92,59.82 8.89,57.78 v2.92,57.78
  Top 0.406: v71.12,49.66 75.56,49.66 77.6,51.69 81.92,51.69 v83.57,50.04 | v65.28,58.42 v65.28,49.66 | v31.5,40.64 U$1.RAW
  Top 0.61: 89.03,50.04 v83.57,50.04
  Top 1.016: JP4.1 68.38,25.98 70.1,24.26 84.96,24.26 89.03,28.32 89.03,50.04 89.03,61.98 81.53,71.37 81.53,82.42 78.99,84.96 78.74,84.96 | v2.92,57.78 2.92,73.41 | 2.92,73.41 v2.92,73.91 3.43,73.91 | 78.74,84.96 10.16,84.96 7.87,82.68 7.87,78.36 3.43,73.91 | 81.53,82.17 78.74,84.96 | 3.43,73.91 2.92,73.41
  Bottom 0.254: 12.97,27.81 JP3.1 | T1.C T2.C T5.C 58.42,29.08 58.67,29.34 58.67,31.5 | 58.67,31.5 58.67,32.51 | C13.1 58.55,31.37 58.67,31.5
  Bottom 0.305: 80.54,54.36 80.52,54.36 | 65.28,57.91 v65.28,58.42 | 78.23,56.64 75.95,56.64 | C9.1 78.23,58.17 | C8.1 47.54,48.48 45.97,48.52 | R24.2 27.5,71.44 26.16,70.1 26.16,67.69 v23.37,64.9 23.37,45.72 U$1.RAW | R19.2 9.08,71.87 6.99,73.96 2.92,73.96 2.87,74.04 v2.92,73.91 | 12.83,27.56 12.97,27.81 | IC2.14 45.97,48.52 | 45.97,48.52 | 12.95,27.81 12.83,27.69
  Bottom 0.406: 80.54,54.36 83.57,51.31 83.57,50.13 C3.1 | 69.6,47.24 71.12,47.24 v71.12,49.66 v65.28,49.66 61.47,49.66 60.35,48.54 45.97,48.52 | IC5.14 64.01,56.64 65.28,57.91 | 80.52,54.36 78.23,56.64 78.23,58.17 | C10.1 66.29,61.63 66.29,59.31 65.41,58.42 v65.28,58.42 | R3.1 58.67,32.51 66.55,32.51 68.33,30.73 68.33,27.85 JP4.1 | v31.5,40.64 31.5,50.67 SG3.- C12.1 | 2.92,42.16 2.92,42.04
  Bottom 0.61: 83.57,50.13 v83.57,50.04 IC3.14 | 68.45,27.8 JP4.1 68.45,27.73 | C2.+ 70.72,18.94 | 12.95,27.69 12.83,27.81
  Bottom 0.813: L1.2 88.11,17.35 84.45,21.01 78.26,21.01 78.33,20.98 76.3,18.95 C1.+
  Bottom 1.016: 68.45,27.73 68.45,21.22 C2.+ C1.+ | 12.83,27.81 12.95,27.94 12.95,30.86 2.92,40.89 2.92,42.04 v2.92,57.78
VIDEO
  Bottom 0.406: IC4.3 67.06,39.88 66.17,38.99 C11.+
  Bottom 0.61: IC4.2 IC4.3
VIDEO_MIX  (via drill 0.6)  (1 unrouted)
  Top 0.406: v47.24,45.72 64.01,45.72 v65.79,43.94 | 65.66,43.94 78.87,43.94 81.03,41.78 81.03,39.37 v80.9,39.24
  Bottom 0.406: IC2.3 43.43,43.43 45.97,45.72 v47.24,45.72 | v65.79,43.94 IC4.4 | IC3.3 81.03,39.37 v80.9,39.24
VSS  (via drill 0.6)  (4 unrouted)
  Top 1.016: 30.23,43.81 29.84,43.81 | 29.84,43.81 29.72,43.94 27.18,43.94 27.18,42.42 29.72,42.42 29.72,43.69 29.84,43.81 | 12.83,38.86 17.91,38.86 17.91,37.08 13.46,37.08 13.46,37.85 17.14,37.85 17.27,37.97 | 2.41,17.14 1.91,17.14 | 14.99,29.97 15.11,29.84 15.11,26.04 15.75,26.04 15.75,29.46 15.62,29.59 | 70.61,30.48 70.61,25.91 71.25,25.91 71.25,29.72 70.99,29.97 | 11.81,49.02 14.48,49.02 14.48,47.5 11.81,47.5 11.81,49.02
  Bottom 0.305: IC6.7 v67.31,64.26 | v56.64,67.06 IC5.7 | T3.E 6.86,61.71 R21.2 | T4.E 20.39,73.66 R26.2
  Bottom 0.406: 7.92,14.99 6.93,15.01 7.67,16.92 | 82.96,14.99 77.06,14.99 | 80.03,12.12 80.03,18.03 | 10.01,14.99 10.01,17.7 10.03,17.73 10.03,14.99 | 10.03,12.19 10.03,14.99 | 10.03,14.99 7.14,14.99
  Bottom 0.61: 48.51,78.99 48.51,78.49 | U$1.GDN$1 26.92,43.18 26.16,43.94 | 48.26,4.32 48.26,4.45 | JP10.1 4.7,17.27 | JP10.2 4.45,14.73
  Bottom 1.016: 70.87,30.48 70.87,24.13 | 15.49,31.88 15.49,23.62 | 15.24,27.81 15.11,27.81 | 15.11,27.81 15.11,30.48 15.75,30.48 15.75,25.4 15.11,25.4 15.11,27.81 | 70.74,30.1 70.61,30.1 70.61,25.02 71.25,25.02 71.25,30.23 | 11.94,38.86 17.91,38.86 17.91,37.08 13.34,37.08 13.34,37.59 17.14,37.59 17.27,37.72 17.27,38.1 | 14.86,48.9 14.48,48.9 14.35,49.02 12.06,49.02 12.06,47.5 14.1,47.5 14.22,47.62 13.84,48.01 | U$1.GDN$1 27.18,43.18 | 27.18,43.18 26.67,43.69 | 27.81,42.8 28.32,42.8 28.45,42.67 29.08,42.67 29.08,43.69 28.45,43.69 | 28.57,43.18 28.57,43.56 28.45,43.69 | 28.45,43.69 26.67,43.69 | 26.67,43.69 26.54,43.81 | 27.18,43.18 27.69,42.67 28.32,42.67 28.45,42.8 | 28.45,43.69 28.45,43.31
  other vias: 25.65,55.88 23.62,69.34 5.08,59.48 10.9,4.11 88.51,67.27 1.11,77.52 82.3,30.73 33.27,34.29 31.5,39.12 57.15,53.34 29.72,77.72 61.09,17.78 58.42,17.78 55.75,17.78 48.01,17.78 50.55,17.78 45.47,17.78 40.39,20.45 84.86,30.73 79.6,30.73 82.32,34.42 85.12,37.97 85.12,40.01 85.12,42.04 79.65,34.42 44.07,38.99 36.96,46.35 34.8,54.61 74.04,45.72 82.42,55.63 61.09,72.39 63.12,72.39 65.15,72.39 67.18,72.39 69.22,72.39 6.6,33.02 30.23,22.35 28.19,22.35 26.16,22.35 24.13,22.35 22.1,22.35 20.07,22.35 18.03,22.35 16,22.35 32.26,22.35 34.29,22.35 36.32,22.35 13.97,22.35 87.53,42.04 87.53,40.01 87.53,37.97 87.53,35.94 86.13,32.51 86.13,45.47 87.53,44.07 74.65,30.73 19.05,30.23 21.59,30.23 43.43,8.64 42.04,10.03 40.39,11.68 40.39,15.24 85.12,35.94 24.41,30.23 4.57,37.08 2.54,37.08 8,31.62 10.67,37.08 35.84,29.97 33.3,29.97 76.94,30.73 87.53,33.91 10.16,90.42 12.19,90.42 79.88,90.42 77.85,90.42 81.92,90.42 8.13,90.42 11.18,83.06 33.3,32.13 35.84,32.26 74.04,42.42 72.01,42.42 74.68,36.45 74.55,38.99 76.58,38.99 78.61,38.99 72.52,38.99 49.02,44.58 51.05,44.58 53.09,44.58 60.33,43.18 52.58,47.12 49.02,42.04 51.05,42.04 53.09,42.04 55.12,42.04 58.8,40.39 62.48,35.69 64.52,35.69 66.55,35.69 68.58,35.69 70.61,35.69 35.84,27.56 33.3,27.69 1.11,75.49 1.11,73.46 85.46,70.57 85.46,75.65 68.33,39.12 54.36,31.24 55.5,25.78 50.67,25.65 47.5,25.65 41.91,30.23 45.21,33.53 43.56,31.88 54.36,33.53 56.39,33.53 58.42,33.53 60.45,33.53 62.48,33.53 64.52,33.53 66.55,33.53 68.58,33.53 57.15,42.04 52.32,35.69 54.36,35.69 56.39,35.69 58.42,35.69 60.45,35.69 48.26,12.32 57.15,12.32 61.47,9.78 61.47,7.75 61.47,5.71 66.93,11.94 64.9,11.94 62.87,11.94 70.61,33.53 50.29,35.69 50.55,47.12 59.69,47.12 44.07,36.96 40.39,39.12 47.24,35.69 47.24,33.53 40.26,28.57 39.88,32.26 41.53,33.91 38.23,30.61 39.5,35.94 37.85,34.29 37.87,27.56 31.27,32.13 29.24,32.13 27.2,32.13 25.68,31.62 31.27,29.97 31.27,27.69 31.24,34.29 35.69,39.12 35.69,37.08 33.53,39.12 33.53,41.15 60.45,31.37 62.48,31.37 64.52,31.37 61.34,37.85 59.31,37.85 57.28,37.85 70.61,31.5 34.92,46.35 66.93,53.34 68.96,53.34 63.63,53.34 61.59,53.34 32.77,54.61 40.89,54.61 38.86,54.61 36.83,54.61 33.27,62.74 36.96,48.77 34.92,48.77 16.51,57.02 6.95,72.19 74.65,32.77
  pour Top: -0.51,92.58 90.55,92.46 90.68,-0.76 -0.51,-0.64
  pour Bottom: -0.76,92.58 90.81,92.2 90.93,-0.51 -1.02,-0.13
(copper drawn outside any net)
  shapes: Bottom circle x2

### Text on the board
Notes: 5.8GHZ FPV DIVERSITY RECEIVER CONTROLLER (TO CONTROL 2X RX5808-PRO ENABLED RX5808 RADIO MODULES http://code.google.com/p/rx5808-pro/) | V1.2 © MIKE DALTON 2015